# Altium schematic sheet 01 COVER.SchDoc
size 513 x 386 mm
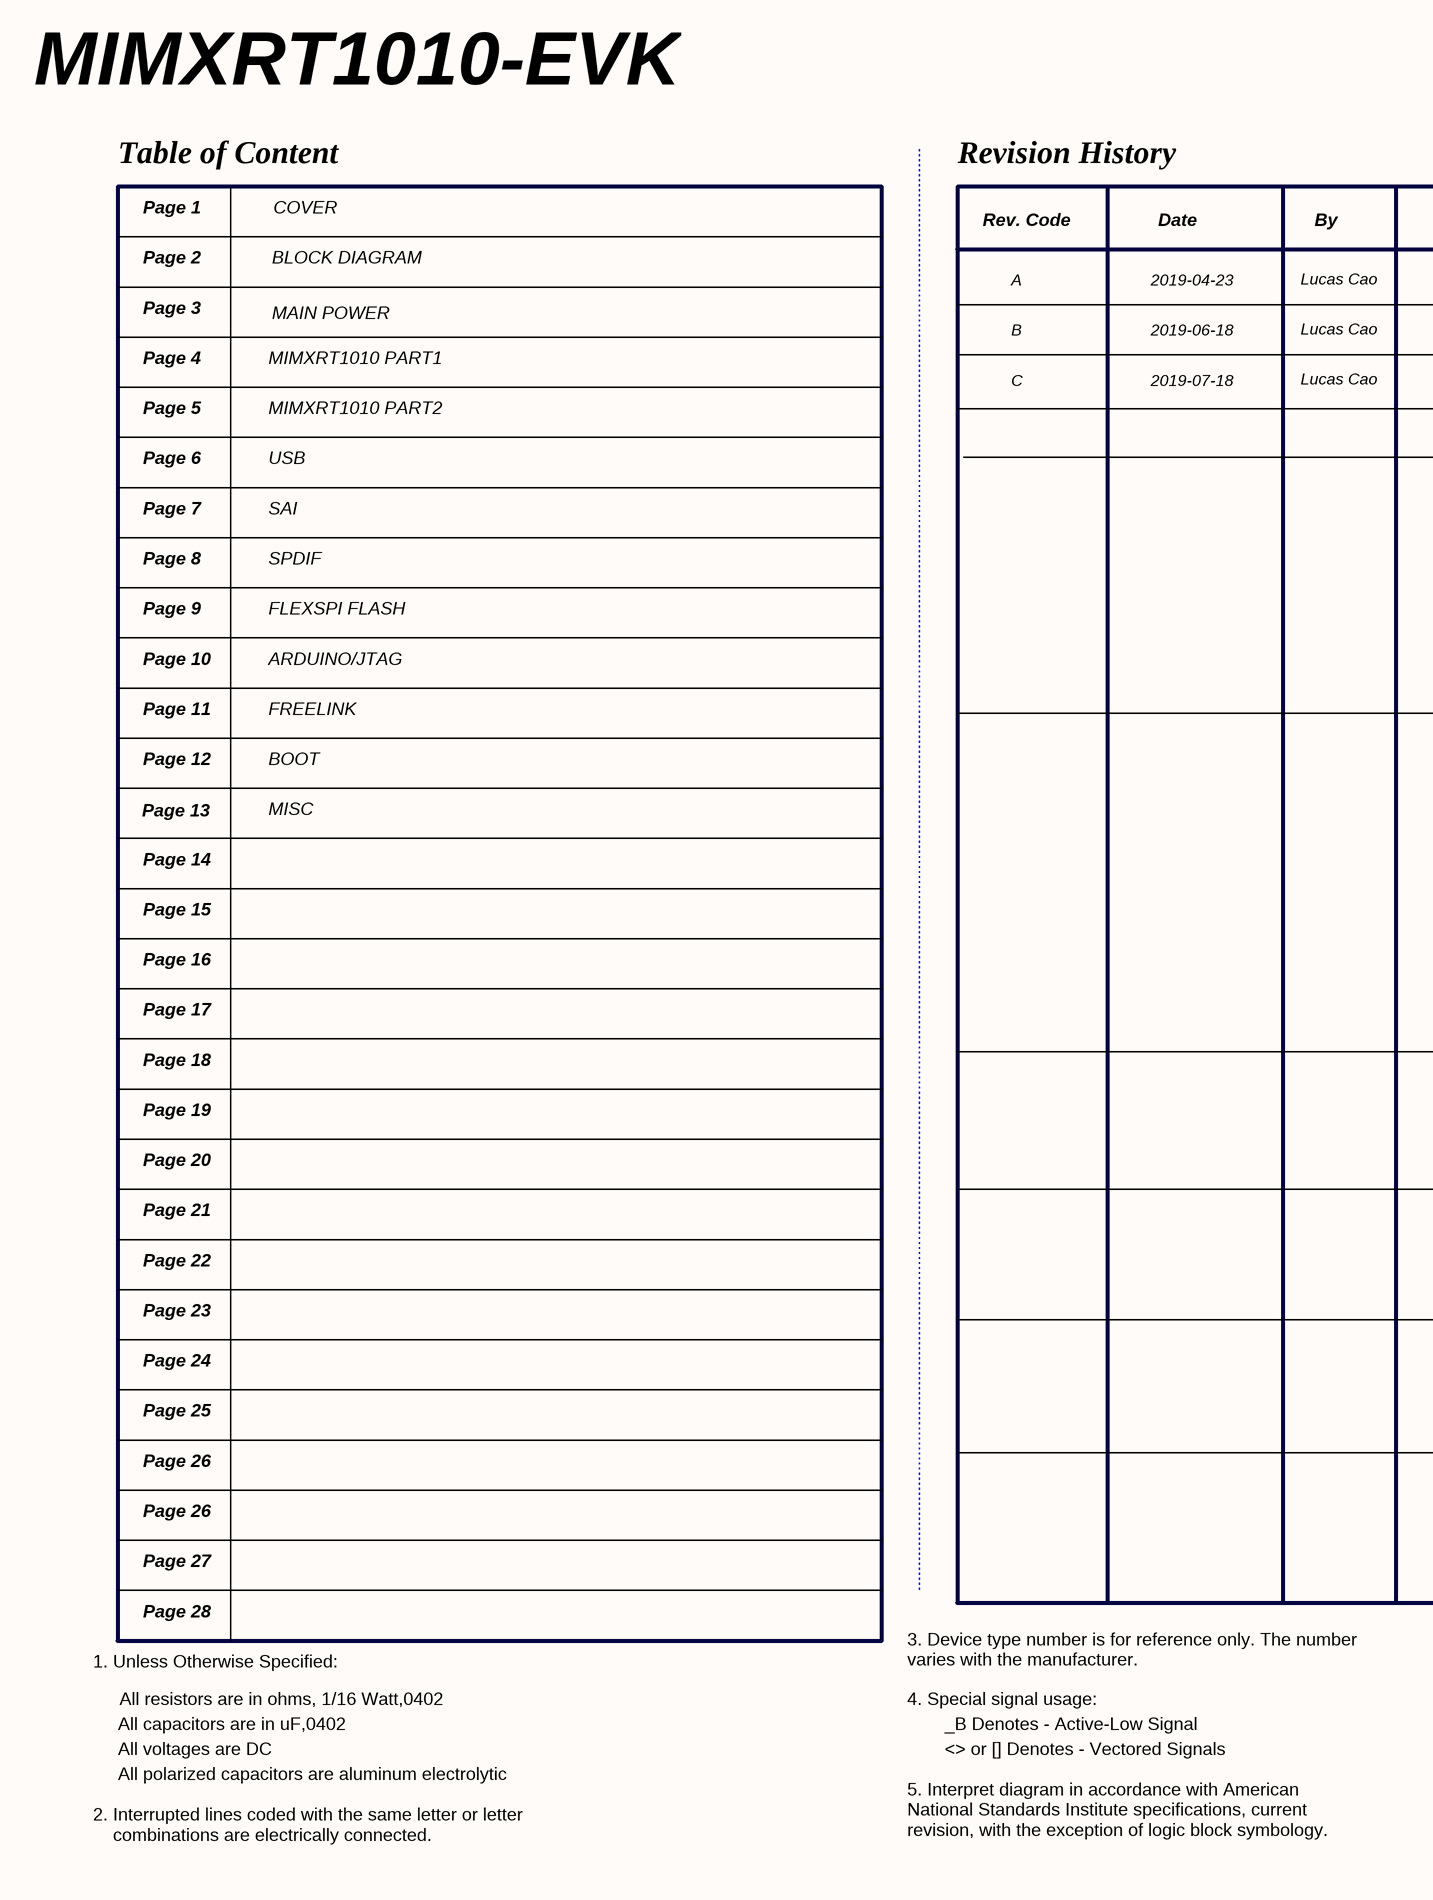
[diagram p0: 01 COVER.SchDoc, left]
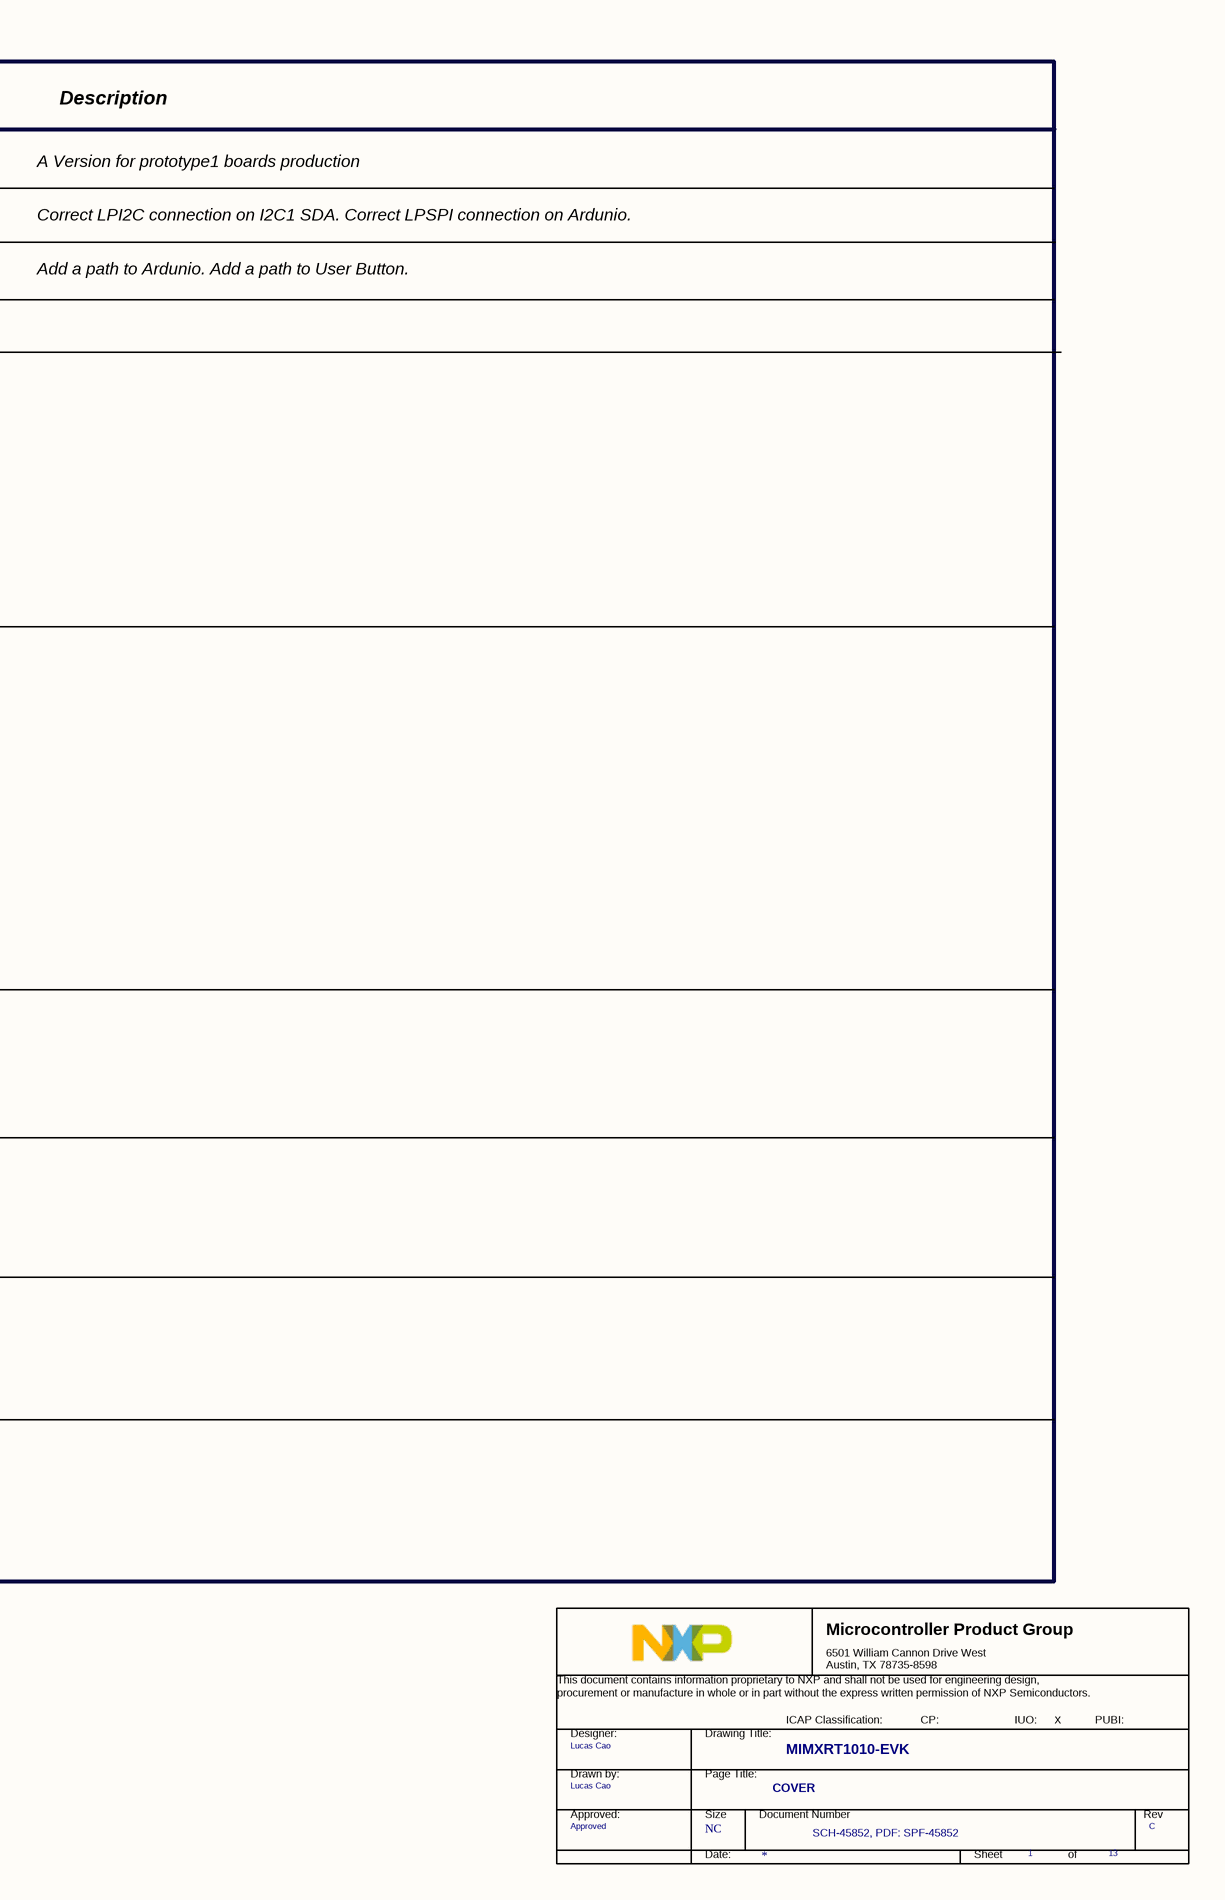
[diagram p1: 01 COVER.SchDoc, right]

## Parts
*  Doc: SCH-45852, PDF: SPF-45852  RevCode: C  Title: MIMXRT1010-EVK  Page Size: NC  Page Number: 1  Page Count: 13  PageTitle: COVER  Designer: Lucas Cao  Approver: Approved  (hidden comment: TitleBlock_MCPG)  (graphical)

## Notes on the sheet
- MIMXRT1010-EVK
- Table of Content
- Revision History
- Page 1
- Page 2
- BLOCK DIAGRAM
- COVER
- Rev. Code
- Date
- By
- Description
- Page 3
- MAIN POWER
- A
- B
- 2019-04-23
- 2019-06-18
- Lucas Cao
- A Version for prototype1 boards production
- Correct LPI2C connection on I2C1 SDA. Correct LPSPI connection on Ardunio.
- Page 4
- MIMXRT1010 PART1
- C
- 2019-07-18
- Add a path to Ardunio. Add a path to User Button.
- Page 5
- MIMXRT1010 PART2
- Page 6
- Page 7
- USB
- SAI
- Page 8
- SPDIF
- Page 9
- FLEXSPI FLASH
- Page 10
- ARDUINO/JTAG
- Page 11
- Page 12
- FREELINK
- BOOT
- Page 13
- MISC
- Page 14
- Page 15
- Page 16
- Page 17
- Page 18
- Page 19
- Page 20
- Page 21
- Page 22
- Page 23
- Page 24
- Page 25
- Page 26
- Page 27
- Page 28
- 3. Device type number is for reference only. The number
  varies with the manufacturer.
- 1. Unless Otherwise Specified:
- All resistors are in ohms, 1/16 Watt,0402
- 4. Special signal usage:
- All capacitors are in uF,0402
- All voltages are DC
- 5. Interpret diagram in accordance with American
  National Standards Institute specifications, current
  revision, with the exception of logic block symbology.
- _B Denotes - Active-Low Signal
- <> or [] Denotes - Vectored Signals
- X
- 2. Interrupted lines coded with the same letter or letter
  combinations are electrically connected.
- All polarized capacitors are aluminum electrolytic
- (in symbol TitleBlock_MCPG) Microcontroller Product Group; 6501 William Cannon Drive West / Austin, TX 78735-8598; This document contains information proprietary to NXP and shall not be used for engineering design,; procurement or manufacture in whole or in part without the express written permission of NXP Semiconductors.; ICAP Classification:; CP:; IUO:; PUBI:; Designer:; Drawing Title:; Drawn by:; Page Title:; Approved:; Size; Document Number; Rev; Date:; Sheet; of

## Library data of the parts
* = TitleBlock_MCPG: PUBI: ___; FIUO: X; OrgName: NXP Semiconductors; OrgAddr1: 6501 William Cannon Drive West; OrgAddr2: Austin, TX 78735-8598; Page Create Date: March  8, 1995; DrawnBy: Lucas Cao; Page Modify Date: *